# Altium project Local Master.PrjPCB
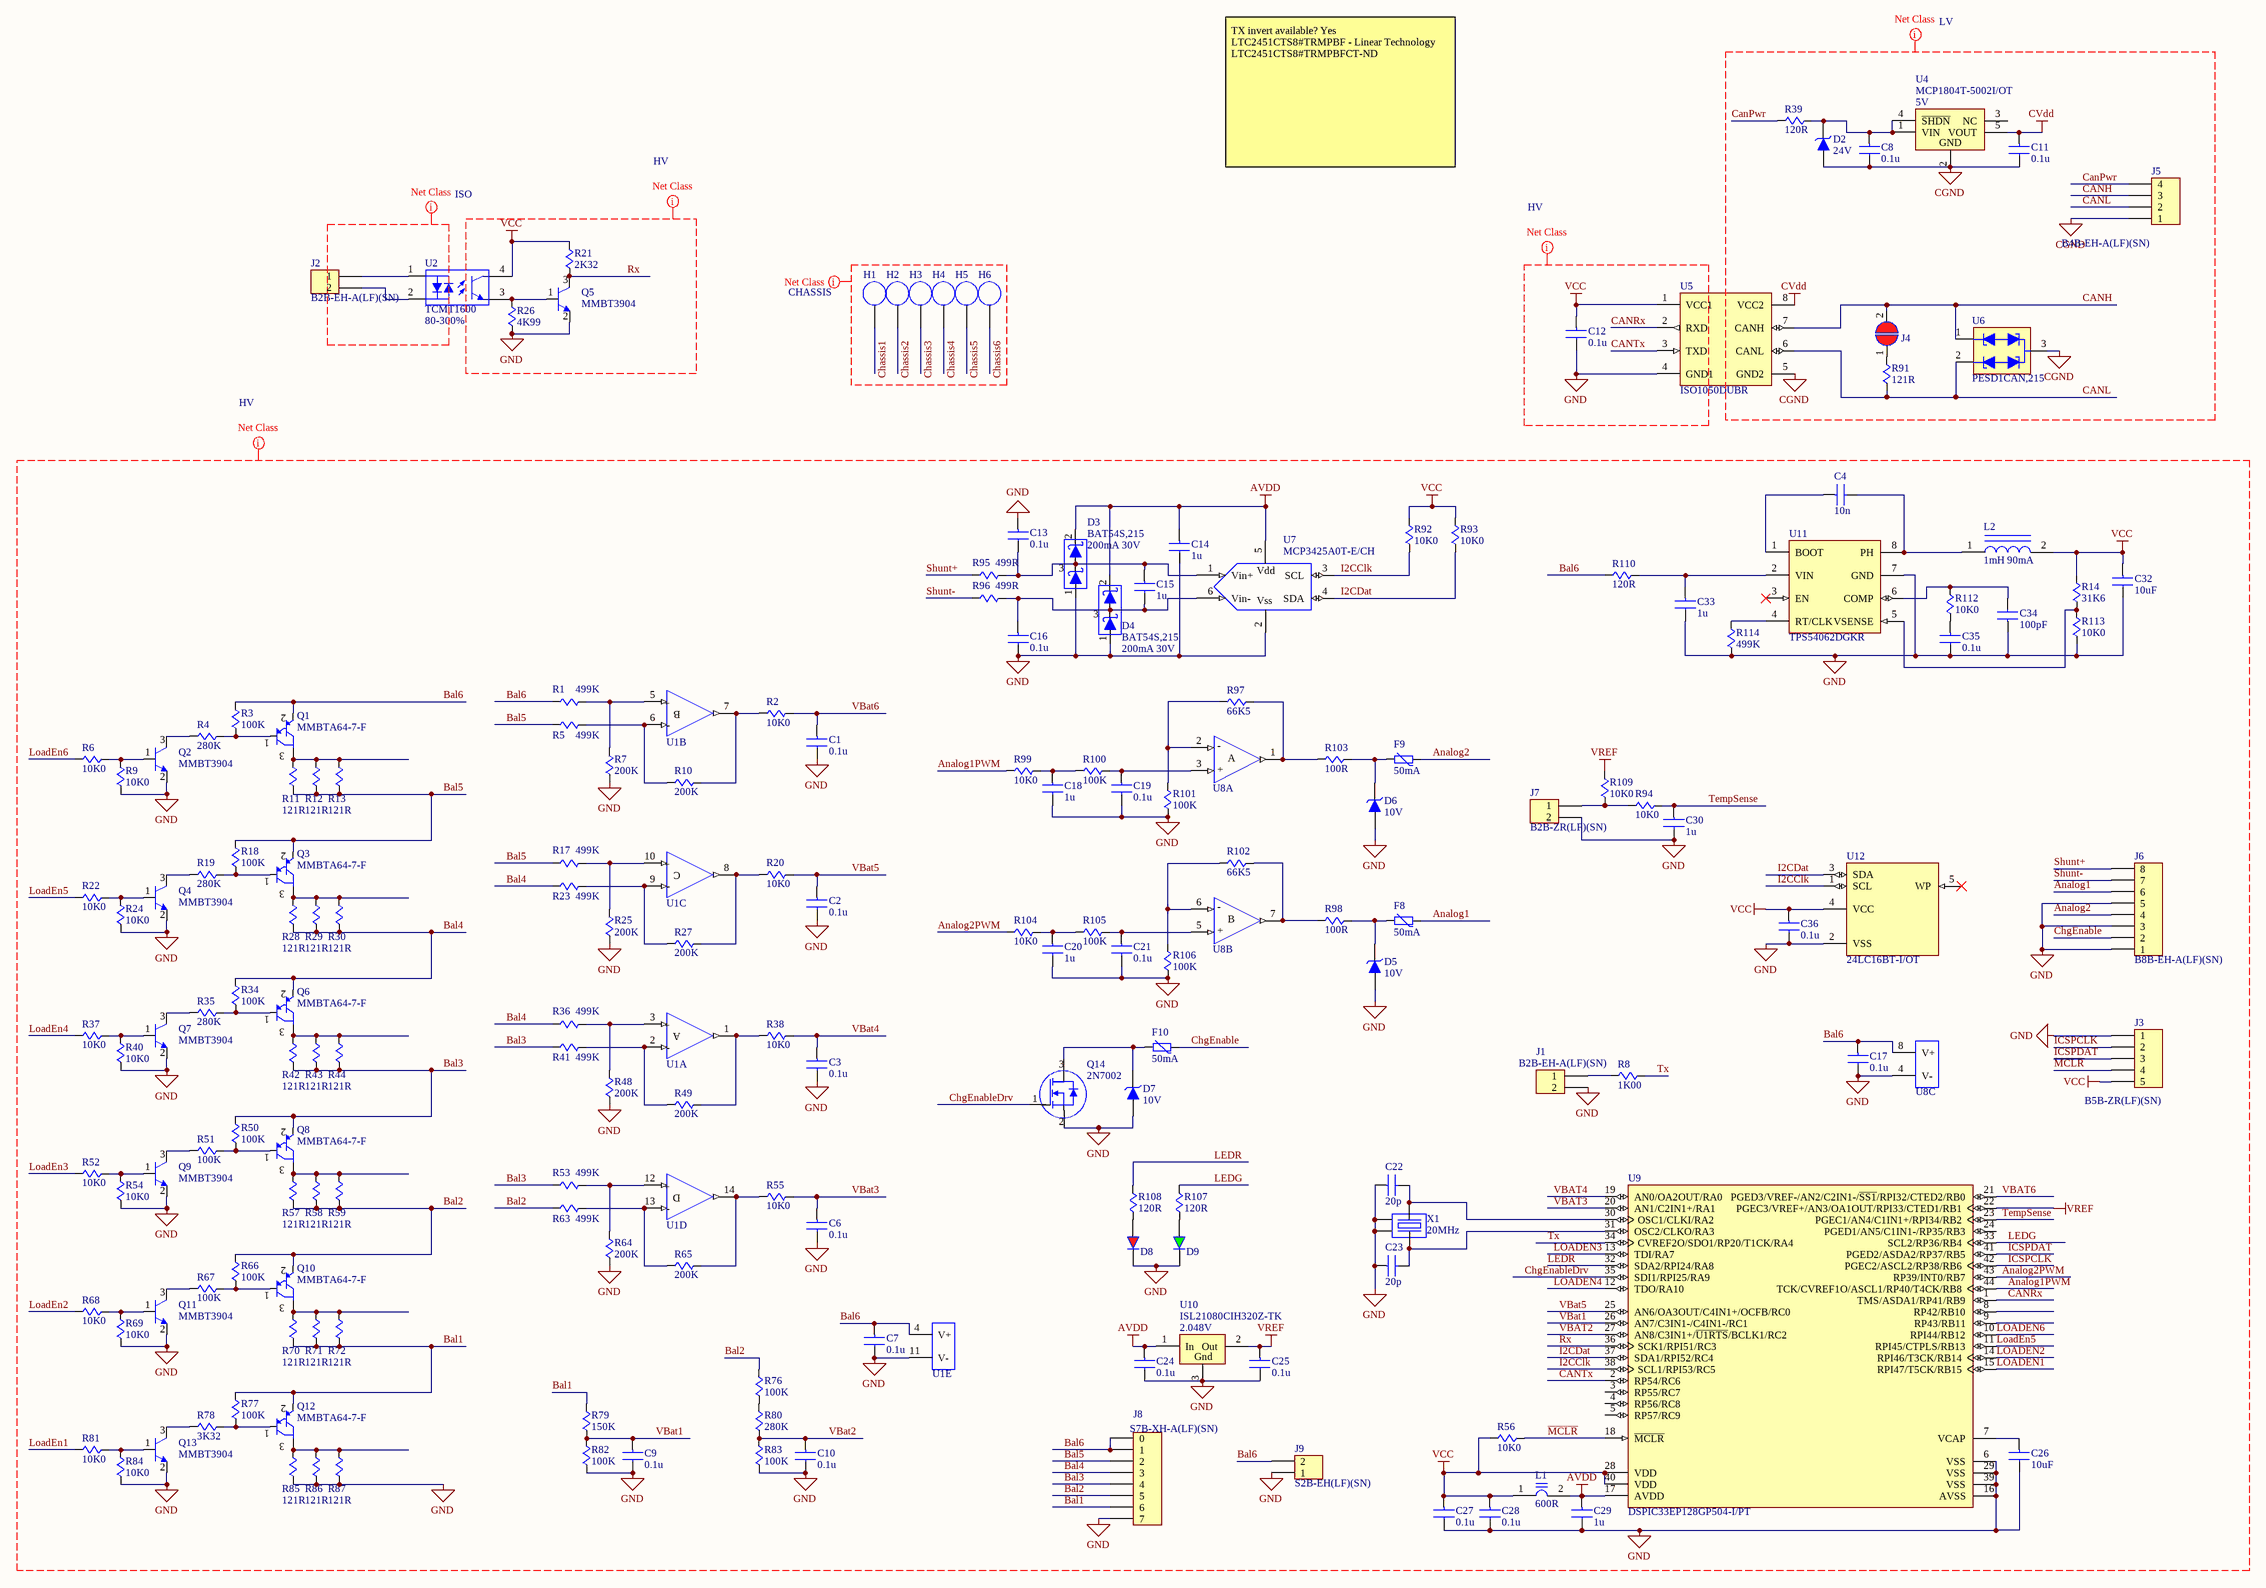
[diagram p0: Local Master.SchDoc]
1 sheet, 184 parts. Net scope: global (net labels, ports and power ports of the same name join across sheets).
Board file: Local Master.PcbDoc

## Sheet Local Master.SchDoc
size C

### Parts
C1  value 0.1u  [CAPC1608N-0603]  (hidden comment: Cap Ceramic 0.1u 25V X7R 0603)
C2  value 0.1u  [CAPC1608N-0603]  (hidden comment: Cap Ceramic 0.1u 25V X7R 0603)
C3  value 0.1u  [CAPC1608N-0603]  (hidden comment: Cap Ceramic 0.1u 25V X7R 0603)
C4  value 10n  [CAPC1608N-0603]  (hidden comment: Cap Ceramic 10n 50V X7R 0603)
C6  value 0.1u  [CAPC1608N-0603]  (hidden comment: Cap Ceramic 0.1u 25V X7R 0603)
C7  value 0.1u  [CAPC1608N-0603]  (hidden comment: Cap Ceramic 0.1u 50V X7R 0603)
C8  value 0.1u  [CAPC1608N-0603]  (hidden comment: Cap Ceramic 0.1u 50V X7R 0603)
C9  value 0.1u  [CAPC1608N-0603]  (hidden comment: Cap Ceramic 0.1u 25V X7R 0603)
C10  value 0.1u  [CAPC1608N-0603]  (hidden comment: Cap Ceramic 0.1u 25V X7R 0603)
C11  value 0.1u  [CAPC1608N-0603]  (hidden comment: Cap Ceramic 0.1u 25V X7R 0603)
C12  value 0.1u  [CAPC1608N-0603]  (hidden comment: Cap Ceramic 0.1u 25V X7R 0603)
C13  value 0.1u  [CAPC1608N-0603]  (hidden comment: Cap Ceramic 0.1u 25V X7R 0603)
C14  value 1u  [CAPC1608N-0603]  (hidden comment: Cap Ceramic 1u 25V X5R 0603)
C15  value 1u  [CAPC1608N-0603]  (hidden comment: Cap Ceramic 1u 25V X5R 0603)
C16  value 0.1u  [CAPC1608N-0603]  (hidden comment: Cap Ceramic 0.1u 25V X7R 0603)
C17  value 0.1u  [CAPC1608N-0603]  (hidden comment: Cap Ceramic 0.1u 50V X7R 0603)
C18  value 1u  [CAPC1608N-0603]  (hidden comment: Cap Ceramic 1u 25V X5R 0603)
C19  value 0.1u  [CAPC1608N-0603]  (hidden comment: Cap Ceramic 0.1u 25V X7R 0603)
C20  value 1u  [CAPC1608N-0603]  (hidden comment: Cap Ceramic 1u 25V X5R 0603)
C21  value 0.1u  [CAPC1608N-0603]  (hidden comment: Cap Ceramic 0.1u 25V X7R 0603)
C22  value 20p  [CAPC1608N-0603]  (hidden comment: Cap Ceramic 20p 50V C0G 0603)
C23  value 20p  [CAPC1608N-0603]  (hidden comment: Cap Ceramic 20p 50V C0G 0603)
C24  value 0.1u  [CAPC1608N-0603]  (hidden comment: Cap Ceramic 0.1u 25V X7R 0603)
C25  value 0.1u  [CAPC1608N-0603]  (hidden comment: Cap Ceramic 0.1u 25V X7R 0603)
C26  value 10uF  [CAPC1608N-0603]  (hidden comment: Cap Ceramic 10u 6.3V X5R 0603)
C27  value 0.1u  [CAPC1608N-0603]  (hidden comment: Cap Ceramic 0.1u 25V X7R 0603)
C28  value 0.1u  [CAPC1608N-0603]  (hidden comment: Cap Ceramic 0.1u 25V X7R 0603)
C29  value 1u  [CAPC1608N-0603]  (hidden comment: Cap Ceramic 1u 25V X5R 0603)
C30  value 1u  [CAPC1608N-0603]  (hidden comment: Cap Ceramic 1u 25V X5R 0603)
C32  value 10uF  [CAPC1608N-0603]  (hidden comment: Cap Ceramic 10u 6.3V X5R 0603)
C33  value 1u  [CAPC1608N-0603]  (hidden comment: Cap Ceramic 1u 50V X5R 0603)
C34  value 100pF  [CAPC1608N-0603]  (hidden comment: Cap Ceramic 100pF 50V C0G 0402)
C35  value 0.1u  [CAPC1608N-0603]  (hidden comment: Cap Ceramic 0.1u 25V X7R 0603)
C36  value 0.1u  [CAPC1608N-0603]  (hidden comment: Cap Ceramic 0.1u 25V X7R 0603)
D2  value 24V  [SOD-123]  (hidden comment: Diode Zener 24V 0.5W SOD-123)
D3  value 200mA 30V  [SOT23-3N]  (hidden comment: Diode Schottky 200mA 30V Series SOT-23)
D4  value 200mA 30V  [SOT23-3N]  (hidden comment: Diode Schottky 200mA 30V Series SOT-23)
D5  value 10V  [SOD-123]  (hidden comment: Diode Zener 10V 0.5W SOD-123)
D6  value 10V  [SOD-123]  (hidden comment: Diode Zener 10V 0.5W SOD-123)
D7  value 10V  [SOD-123]  (hidden comment: Diode Zener 10V 0.5W SOD-123)
D8  LED Red 160° 0603  [CAPC1608N-0603]  (value not drawn)
D9  LED Green 160° 0603  [CAPC1608N-0603]  (value not drawn)
F8  value 50mA  [RESC3216N-1206]  (hidden comment: Fuse PTC 50mA 60V 1206)
F9  value 50mA  [RESC3216N-1206]  (hidden comment: Fuse PTC 50mA 60V 1206)
F10  value 50mA  [RESC3216N-1206]  (hidden comment: Fuse PTC 50mA 60V 1206)
H1  Mounting Hole  [HOLE MOUNTING 3MM]  (value not drawn)  (no BOM)
H2  Mounting Hole  [HOLE MOUNTING 3MM]  (value not drawn)  (no BOM)
H3  Mounting Hole  [HOLE MOUNTING 3MM]  (value not drawn)  (no BOM)
H4  Mounting Hole  [HOLE MOUNTING 3MM]  (value not drawn)  (no BOM)
H5  Mounting Hole  [HOLE MOUNTING 3MM]  (value not drawn)  (no BOM)
H6  Mounting Hole  [HOLE MOUNTING 3MM]  (value not drawn)  (no BOM)
J1  value B2B-EH-A(LF)(SN)  [B2B-EH]  (hidden comment: Conn Header 2.5mm Vert 2-Pos EH)
J2  value B2B-EH-A(LF)(SN)  [B2B-EH]  (hidden comment: Conn Header 2.5mm Vert 2-Pos EH)
J3  value B5B-ZR(LF)(SN)  [B5B-ZR]  (hidden comment: Conn Header 1.5mm Vert 5-Pos ZH)
J4  Jumper Solder Blob  [JUMPER SOLDER BLOB]  (value not drawn)  (no BOM)
J5  value B4B-EH-A(LF)(SN)  [B4B-EH]  (hidden comment: Conn Header 2.5mm Vert 4-Pos EH)
J6  value B8B-EH-A(LF)(SN)  [B8B-EH]  (hidden comment: Conn Header 2.5mm Vert 8-Pos EH)
J7  value B2B-ZR(LF)(SN)  [B2B-ZR]  (hidden comment: Conn Header 1.5mm Vert 2-Pos ZH)
J8  value S7B-XH-A(LF)(SN)  [S7B-XH&78B-XH-REV]  (hidden comment: Conn Header 2.5mm RA 7-Pos XH)
J9  value S2B-EH(LF)(SN)  [S2B-EH]  (hidden comment: Conn Header 2.5mm RA 2-Pos EH)
L1  value 600R  [INDC1608N-0603]  (hidden comment: Ind Bead 600R 1A 0603)
L2  value 1mH 90mA  [SDR0403]  (hidden comment: Ind 1mH 90mA SDR0403-102KL)
Q1  value MMBTA64-7-F  [SOT23-3N]  (hidden comment: Tran PNP Darl 30V 500mA SOT-23)
Q2  value MMBT3904  [SOT23-3N]  (hidden comment: Tran NPN 40V 200mA SOT-23)
Q3  value MMBTA64-7-F  [SOT23-3N]  (hidden comment: Tran PNP Darl 30V 500mA SOT-23)
Q4  value MMBT3904  [SOT23-3N]  (hidden comment: Tran NPN 40V 200mA SOT-23)
Q5  value MMBT3904  [SOT23-3N]  (hidden comment: Tran NPN 40V 200mA SOT-23)
Q6  value MMBTA64-7-F  [SOT23-3N]  (hidden comment: Tran PNP Darl 30V 500mA SOT-23)
Q7  value MMBT3904  [SOT23-3N]  (hidden comment: Tran NPN 40V 200mA SOT-23)
Q8  value MMBTA64-7-F  [SOT23-3N]  (hidden comment: Tran PNP Darl 30V 500mA SOT-23)
Q9  value MMBT3904  [SOT23-3N]  (hidden comment: Tran NPN 40V 200mA SOT-23)
Q10  value MMBTA64-7-F  [SOT23-3N]  (hidden comment: Tran PNP Darl 30V 500mA SOT-23)
Q11  value MMBT3904  [SOT23-3N]  (hidden comment: Tran NPN 40V 200mA SOT-23)
Q12  value MMBTA64-7-F  [SOT23-3N]  (hidden comment: Tran PNP Darl 30V 500mA SOT-23)
Q13  value MMBT3904  [SOT23-3N]  (hidden comment: Tran NPN 40V 200mA SOT-23)
Q14  value 2N7002  [SOT23-3N]  (hidden comment: Tran N-MOSFET 60V 115mA SOT-23)
R1  value 499K  [RESC1608N-0603]  (hidden comment: Res 499K 1/10W 1% 0603)
R2  value 10K0  [RESC1608N-0603]  (hidden comment: Res 10.0K 1/10W 1% 0603)
R3  value 100K  [RESC1608N-0603]  (hidden comment: Res 100K 1/10W 1% 0603)
R4  value 280K  [RESC1608N-0603]  (hidden comment: Res 280K 1/10W 1% 0603)
R5  value 499K  [RESC1608N-0603]  (hidden comment: Res 499K 1/10W 1% 0603)
R6  value 10K0  [RESC1608N-0603]  (hidden comment: Res 10.0K 1/10W 1% 0603)
R7  value 200K  [RESC1608N-0603]  (hidden comment: Res 200K 1/10W 1% 0603)
R8  value 1K00  [RESC1608N-0603]  (hidden comment: Res 1.00K 1/10W 1% 0603)
R9  value 10K0  [RESC1608N-0603]  (hidden comment: Res 10.0K 1/10W 1% 0603)
R10  value 200K  [RESC1608N-0603]  (hidden comment: Res 200K 1/10W 1% 0603)
R11  value 121R  [RESC3216N-1206]  (hidden comment: Res 121R 1/4W 1% 1206)
R12  value 121R  [RESC3216N-1206]  (hidden comment: Res 121R 1/4W 1% 1206)
R13  value 121R  [RESC3216N-1206]  (hidden comment: Res 121R 1/4W 1% 1206)
R14  value 31K6  [RESC1608N-0603]  (hidden comment: Res 31.6K 1/10W 1% 0603)
R17  value 499K  [RESC1608N-0603]  (hidden comment: Res 499K 1/10W 1% 0603)
R18  value 100K  [RESC1608N-0603]  (hidden comment: Res 100K 1/10W 1% 0603)
R19  value 280K  [RESC1608N-0603]  (hidden comment: Res 280K 1/10W 1% 0603)
R20  value 10K0  [RESC1608N-0603]  (hidden comment: Res 10.0K 1/10W 1% 0603)
R21  value 2K32  [RESC1608N-0603]  (hidden comment: Res 2.32K 1/10W 1% 0603)
R22  value 10K0  [RESC1608N-0603]  (hidden comment: Res 10.0K 1/10W 1% 0603)
R23  value 499K  [RESC1608N-0603]  (hidden comment: Res 499K 1/10W 1% 0603)
R24  value 10K0  [RESC1608N-0603]  (hidden comment: Res 10.0K 1/10W 1% 0603)
R25  value 200K  [RESC1608N-0603]  (hidden comment: Res 200K 1/10W 1% 0603)
R26  value 4K99  [RESC1608N-0603]  (hidden comment: Res 4.99K 1/10W 1% 0603)
R27  value 200K  [RESC1608N-0603]  (hidden comment: Res 200K 1/10W 1% 0603)
R28  value 121R  [RESC3216N-1206]  (hidden comment: Res 121R 1/4W 1% 1206)
R29  value 121R  [RESC3216N-1206]  (hidden comment: Res 121R 1/4W 1% 1206)
R30  value 121R  [RESC3216N-1206]  (hidden comment: Res 121R 1/4W 1% 1206)
R34  value 100K  [RESC1608N-0603]  (hidden comment: Res 100K 1/10W 1% 0603)
R35  value 280K  [RESC1608N-0603]  (hidden comment: Res 280K 1/10W 1% 0603)
R36  value 499K  [RESC1608N-0603]  (hidden comment: Res 499K 1/10W 1% 0603)
R37  value 10K0  [RESC1608N-0603]  (hidden comment: Res 10.0K 1/10W 1% 0603)
R38  value 10K0  [RESC1608N-0603]  (hidden comment: Res 10.0K 1/10W 1% 0603)
R39  value 120R  [RESC1608N-0603]  (hidden comment: Res 120R 1/10W 1% 0603)
R40  value 10K0  [RESC1608N-0603]  (hidden comment: Res 10.0K 1/10W 1% 0603)
R41  value 499K  [RESC1608N-0603]  (hidden comment: Res 499K 1/10W 1% 0603)
R42  value 121R  [RESC3216N-1206]  (hidden comment: Res 121R 1/4W 1% 1206)
R43  value 121R  [RESC3216N-1206]  (hidden comment: Res 121R 1/4W 1% 1206)
R44  value 121R  [RESC3216N-1206]  (hidden comment: Res 121R 1/4W 1% 1206)
R48  value 200K  [RESC1608N-0603]  (hidden comment: Res 200K 1/10W 1% 0603)
R49  value 200K  [RESC1608N-0603]  (hidden comment: Res 200K 1/10W 1% 0603)
R50  value 100K  [RESC1608N-0603]  (hidden comment: Res 100K 1/10W 1% 0603)
R51  value 100K  [RESC1608N-0603]  (hidden comment: Res 100K 1/10W 1% 0603)
R52  value 10K0  [RESC1608N-0603]  (hidden comment: Res 10.0K 1/10W 1% 0603)
R53  value 499K  [RESC1608N-0603]  (hidden comment: Res 499K 1/10W 1% 0603)
R54  value 10K0  [RESC1608N-0603]  (hidden comment: Res 10.0K 1/10W 1% 0603)
R55  value 10K0  [RESC1608N-0603]  (hidden comment: Res 10.0K 1/10W 1% 0603)
R56  value 10K0  [RESC1608N-0603]  (hidden comment: Res 10.0K 1/10W 1% 0603)
R57  value 121R  [RESC3216N-1206]  (hidden comment: Res 121R 1/4W 1% 1206)
R58  value 121R  [RESC3216N-1206]  (hidden comment: Res 121R 1/4W 1% 1206)
R59  value 121R  [RESC3216N-1206]  (hidden comment: Res 121R 1/4W 1% 1206)
R63  value 499K  [RESC1608N-0603]  (hidden comment: Res 499K 1/10W 1% 0603)
R64  value 200K  [RESC1608N-0603]  (hidden comment: Res 200K 1/10W 1% 0603)
R65  value 200K  [RESC1608N-0603]  (hidden comment: Res 200K 1/10W 1% 0603)
R66  value 100K  [RESC1608N-0603]  (hidden comment: Res 100K 1/10W 1% 0603)
R67  value 100K  [RESC1608N-0603]  (hidden comment: Res 100K 1/10W 1% 0603)
R68  value 10K0  [RESC1608N-0603]  (hidden comment: Res 10.0K 1/10W 1% 0603)
R69  value 10K0  [RESC1608N-0603]  (hidden comment: Res 10.0K 1/10W 1% 0603)
R70  value 121R  [RESC3216N-1206]  (hidden comment: Res 121R 1/4W 1% 1206)
R71  value 121R  [RESC3216N-1206]  (hidden comment: Res 121R 1/4W 1% 1206)
R72  value 121R  [RESC3216N-1206]  (hidden comment: Res 121R 1/4W 1% 1206)
R76  value 100K  [RESC1608N-0603]  (hidden comment: Res 100K 1/10W 1% 0603)
R77  value 100K  [RESC1608N-0603]  (hidden comment: Res 100K 1/10W 1% 0603)
R78  value 3K32  [RESC1608N-0603]  (hidden comment: Res 3.32K 1/10W 1% 0603)
R79  value 150K  [RESC1608N-0603]  (hidden comment: Res 150K 1/10W 1% 0603)
R80  value 280K  [RESC1608N-0603]  (hidden comment: Res 280K 1/10W 1% 0603)
R81  value 10K0  [RESC1608N-0603]  (hidden comment: Res 10.0K 1/10W 1% 0603)
R82  value 100K  [RESC1608N-0603]  (hidden comment: Res 100K 1/10W 1% 0603)
R83  value 100K  [RESC1608N-0603]  (hidden comment: Res 100K 1/10W 1% 0603)
R84  value 10K0  [RESC1608N-0603]  (hidden comment: Res 10.0K 1/10W 1% 0603)
R85  value 121R  [RESC3216N-1206]  (hidden comment: Res 121R 1/4W 1% 1206)
R86  value 121R  [RESC3216N-1206]  (hidden comment: Res 121R 1/4W 1% 1206)
R87  value 121R  [RESC3216N-1206]  (hidden comment: Res 121R 1/4W 1% 1206)
R91  value 121R  [RESC3216N-1206]  (hidden comment: Res 121R 1/4W 1% 1206)
R92  value 10K0  [RESC1608N-0603]  (hidden comment: Res 10.0K 1/10W 1% 0603)
R93  value 10K0  [RESC1608N-0603]  (hidden comment: Res 10.0K 1/10W 1% 0603)
R94  value 10K0  [RESC1608N-0603]  (hidden comment: Res 10.0K 1/10W 1% 0603)
R95  value 499R  [RESC1608N-0603]  (hidden comment: Res 499R 1/10W 1% 0603)
R96  value 499R  [RESC1608N-0603]  (hidden comment: Res 499R 1/10W 1% 0603)
R97  value 66K5  [RESC1608N-0603]  (hidden comment: Res 66.5K 1/10W 1% 0603)
R98  value 100R  [RESC1608N-0603]  (hidden comment: Res 100R 1/10W 1% 0603)
R99  value 10K0  [RESC1608N-0603]  (hidden comment: Res 10.0K 1/10W 1% 0603)
R100  value 100K  [RESC1608N-0603]  (hidden comment: Res 100K 1/10W 1% 0603)
R101  value 100K  [RESC1608N-0603]  (hidden comment: Res 100K 1/10W 1% 0603)
R102  value 66K5  [RESC1608N-0603]  (hidden comment: Res 66.5K 1/10W 1% 0603)
R103  value 100R  [RESC1608N-0603]  (hidden comment: Res 100R 1/10W 1% 0603)
R104  value 10K0  [RESC1608N-0603]  (hidden comment: Res 10.0K 1/10W 1% 0603)
R105  value 100K  [RESC1608N-0603]  (hidden comment: Res 100K 1/10W 1% 0603)
R106  value 100K  [RESC1608N-0603]  (hidden comment: Res 100K 1/10W 1% 0603)
R107  value 120R  [RESC1608N-0603]  (hidden comment: Res 120R 1/10W 1% 0603)
R108  value 120R  [RESC1608N-0603]  (hidden comment: Res 120R 1/10W 1% 0603)
R109  value 10K0  [RESC1608N-0603]  (hidden comment: Res 10.0K 1/10W 1% 0603)
R110  value 120R  [RESC1608N-0603]  (hidden comment: Res 120R 1/10W 1% 0603)
R112  value 10K0  [RESC1608N-0603]  (hidden comment: Res 10.0K 1/10W 1% 0603)
R113  value 10K0  [RESC1608N-0603]  (hidden comment: Res 10.0K 1/10W 1% 0603)
R114  value 499K  [RESC1608N-0603]  (hidden comment: Res 499K 1/10W 1% 0603)
U1  IC Op-Amp Low Power RRIO 32V 14-SOIC  [SOIC127P600-14N]  (value not drawn)  (parts A,B,C,D,E of 5)
U2  value 80-300%  [MFP127P4.4-4]  (hidden comment: IC Optocoupler Bi-Di LED 80-300% SOIC4)
U4  value 5V  [SOT23-5N]  (hidden comment: IC Voltage Reg LDO 5V SOT-23-5)
U5  value ISO1050DUBR  [SMD-8]  (hidden comment: IC Driver CAN 8-SOIC)
U6  value PESD1CAN,215  [SOT23-3N]  (hidden comment: IC ESD Protector CAN SOT23)
U7  MCP3425A0T-E/CH  [SOT23-6N]
U8  IC Op-Amp Low Power RRIO 32V 8-SOIC  [SOIC127P600-8N]  (value not drawn)  (parts A,B,C of 3)
U9  value DSPIC33EP128GP504-I/PT  [TQFP44-0.8]  (hidden comment: IC Micro DSPIC33EP128GP504-I/PT 44-TQFP)
U10  value 2.048V  [SOT23-3N]  (hidden comment: IC Voltage Ref 2.048V 0.3% uPwr SOT-23)
U11  value TPS54062DGKR  [MSOP65P3.0-8N]  (hidden comment: IC Reg Buck 4.7-60V 50mA 8-MSOP)
U12  value 24LC16BT-I/OT  [SOT23-5N]  (hidden comment: IC Mem EEPROM 16Kb (2K x 8) I2C SOT-23-5)
X1  value 20MHz  [XTAL3.2X2.5]  (hidden comment: Xtal 20MHz 10pF 3.2X2.5MM)

### Nets
AVDD: C14.1 C24.1 C29.1 D3.2(Anode2) D4.2(Anode2) L1.2 U7.5(Vdd) U9.17(AVDD) U10.1(In)
CGND: C8.2 C11.2 D2.2(Anode) J5.1 U4.2(GND) U5.5(GND2) U6.3(Com)
CVdd: C11.1 U4.5(VOUT) U5.8(VCC2)
GND: C1.2 C2.2 C3.2 C6.2 C7.2 C9.2 C10.2 C12.2 C13.1 C14.2 C16.2 C17.2 C18.2 C19.2 C20.2 C21.2 C22.1 C23.1 C24.2 C25.2 C26.2 C27.2 C28.2 C29.2 C30.2 C32.2 C33.2 C34.1 C35.2 C36.2 D3.1(Anode1) D4.1(Anode1) D5.2(Anode) D6.2(Anode) D7.2(Anode) D8.1(Cathode) D9.1(Cathode) J1.2 J3.1 J6.1 J6.3 J6.5 J7.2 J8.7 J9.1 Q2.2(E) Q4.2(E) Q5.2(E) Q7.2(E) Q9.2(E) Q11.2(E) Q13.2(E) Q14.2(Source) R7.1 R9.1 R24.1 R25.1 R26.1 R40.1 R48.1 R54.1 R64.1 R69.1 R82.1 R83.1 R84.1 R85.1 R86.1 R87.1 R101.1 R106.1 R113.1 R114.1 U1.11(V-) U5.4(GND1) U7.2(Vss) U8.4(V-) U9.6(VSS) U9.16(AVSS) U9.29(VSS) U9.39(VSS) U10.3(Gnd) U11.7(GND) U12.2(VSS) X1.2 X1.4
VCC: C12.1 C27.1 C28.1 C32.1 C36.1 J3.5 L1.1 L2.2 R14.2 R21.2 R56.2 R92.2 R93.2 U2.4(Collector) U5.1(VCC1) U9.28(VDD) U9.40(VDD) U12.4(VCC)
VREF: C25.1 R109.2 U9.22(PGEC3/VREF+/AN3/OA1OUT/RPI33/CTED1/RB1) U10.2(Out)
Analog1: F8.2 J6.6
Analog1PWM: R99.1 U9.44(TCK/CVREF1O/ASCL1/RP40/T4CK/RB8)
Analog2: F9.2 J6.4
Analog2PWM: R104.1 U9.43(RP39/INT0/RB7)
Bal1: J8.6 Q12.2(Emitter) R70.1 R71.1 R72.1 R77.2 R79.2
Bal2: J8.5 Q10.2(Emitter) R57.1 R58.1 R59.1 R63.1 R66.2 R76.2
Bal3: J8.4 Q8.2(Emitter) R41.1 R42.1 R43.1 R44.1 R50.2 R53.1
Bal4: J8.3 Q6.2(Emitter) R23.1 R28.1 R29.1 R30.1 R34.2 R36.1
Bal5: J8.2 Q3.2(Emitter) R5.1 R11.1 R12.1 R13.1 R17.1 R18.2
Bal6: C7.1 C17.1 J8.0 J8.1 J9.2 Q1.2(Emitter) R1.1 R3.2 R110.1 U1.4(V+) U8.8(V+)
CANH: J4.2 J5.3 U5.7(CANH) U6.1(C1)
CANL: J5.2 R91.1 U5.6(CANL) U6.2(C2)
CanPwr: J5.4 R39.2
CANRx: U5.2(RXD) U9.1(TMS/ASDA1/RP41/RB9)
CANTx: U5.3(TXD) U9.2(RP54/RC6)
Chassis1: H1.1
Chassis2: H2.1
Chassis3: H3.1
Chassis4: H4.1
Chassis5: H5.1
Chassis6: H6.1
ChgEnable: F10.2 J6.2
ChgEnableDrv: Q14.1(Gate) U9.35(SDI1/RPI25/RA9)
I2CClk: R92.1 U7.3(SCL) U9.38(SCL1/RPI53/RC5) U12.1(SCL)
I2CDat: R93.1 U7.4(SDA) U9.37(SDA1/RPI52/RC4) U12.3(SDA)
ICSPCLK: J3.2 U9.42(PGEC2/ASCL2/RP38/RB6)
ICSPDAT: J3.3 U9.41(PGED2/ASDA2/RP37/RB5)
LEDG: R107.1 U9.33(SCL2/RP36/RB4)
LEDR: R108.1 U9.32(SDA2/RPI24/RA8)
LoadEn1: R81.2 U9.15(RPI47/T5CK/RB15)
LoadEn2: R68.2 U9.14(RPI46/T3CK/RB14)
LoadEn3: R52.2 U9.13(TDI/RA7)
LoadEn4: R37.2 U9.12(TDO/RA10)
LoadEn5: R22.2 U9.11(RPI45/CTPLS/RB13)
LoadEn6: R6.2 U9.10(RPI44/RB12)
~{MCLR}: J3.4 R56.1 U9.18(~{MCLR})
Rx: Q5.3(C) R21.1 U9.36(SCK1/RPI51/RC3)
Shunt+: J6.8 R95.1
Shunt-: J6.7 R96.1
TempSense: C30.1 R94.1 U9.23(PGEC1/AN4/C1IN1+/RPI34/RB2)
Tx: R8.2 U9.34(CVREF2O/SDO1/RP20/T1CK/RA4)
VBat1: C9.1 R79.1 R82.2 U9.26(AN7/C3IN1-/C4IN1-/RC1)
VBat2: C10.1 R80.1 R83.2 U9.27(AN8/C3IN1+/~{U1RTS}/BCLK1/RC2)
VBat3: C6.1 R55.2 U9.20(AN1/C2IN1+/RA1)
VBat4: C3.1 R38.2 U9.19(AN0/OA2OUT/RA0)
VBat5: C2.1 R20.2 U9.25(AN6/OA3OUT/C4IN1+/OCFB/RC0)
VBat6: C1.1 R2.2 U9.21(PGED3/VREF-/AN2/C2IN1-/~{SS1}/RPI32/CTED2/RB0)
NetC4_1: C4.1 U11.1(BOOT)
NetC4_2: C4.2 L2.1 U11.8(PH)
NetC8_1: C8.1 D2.1(Cathode) R39.1 U4.1(VIN) U4.4(~{SHDN})
NetC13_2: C13.2 C15.1 D3.3(Cathode) R95.2 U7.1(Vin+)
NetC15_2: C15.2 C16.1 D4.3(Cathode) R96.2 U7.6(Vin-)
NetC18_1: C18.1 R99.2 R100.1
NetC19_1: C19.1 R100.2 U8.3(+A)
NetC20_1: C20.1 R104.2 R105.1
NetC21_1: C21.1 R105.2 U8.5(+B)
NetC22_2: C22.2 U9.30(OSC1/CLKI/RA2) X1.3
NetC23_2: C23.2 U9.31(OSC2/CLKO/RA3) X1.1
NetC26_1: C26.1 U9.7(VCAP)
NetC33_1: C33.1 R110.2 U11.2(VIN)
NetC34_2: C34.2 R112.1 U11.6(COMP)
NetC35_1: C35.1 R112.2
NetD5_1: D5.1(Cathode) F8.1 R98.2
NetD6_1: D6.1(Cathode) F9.1 R103.2
NetD7_1: D7.1(Cathode) F10.1 Q14.3(Drain)
NetD8_2: D8.2(Anode) R108.2
NetD9_2: D9.2(Anode) R107.2
NetJ1_1: J1.1 R8.1
NetJ2_1: J2.1 U2.1(Anode)
NetJ2_2: J2.2 U2.2(Cathode)
NetJ4_1: J4.1 R91.2
NetJ7_1: J7.1 R94.2 R109.1
NetQ1_1: Q1.1(Base) R3.1 R4.1
NetQ1_3: Q1.3(Collector) R11.2 R12.2 R13.2
NetQ2_1: Q2.1(B) R6.1 R9.2
NetQ2_3: Q2.3(C) R4.2
NetQ3_1: Q3.1(Base) R18.1 R19.1
NetQ3_3: Q3.3(Collector) R28.2 R29.2 R30.2
NetQ4_1: Q4.1(B) R22.1 R24.2
NetQ4_3: Q4.3(C) R19.2
NetQ5_1: Q5.1(B) R26.2 U2.3(Emitter)
NetQ6_1: Q6.1(Base) R34.1 R35.1
NetQ6_3: Q6.3(Collector) R42.2 R43.2 R44.2
NetQ7_1: Q7.1(B) R37.1 R40.2
NetQ7_3: Q7.3(C) R35.2
NetQ8_1: Q8.1(Base) R50.1 R51.1
NetQ8_3: Q8.3(Collector) R57.2 R58.2 R59.2
NetQ9_1: Q9.1(B) R52.1 R54.2
NetQ9_3: Q9.3(C) R51.2
NetQ10_1: Q10.1(Base) R66.1 R67.1
NetQ10_3: Q10.3(Collector) R70.2 R71.2 R72.2
NetQ11_1: Q11.1(B) R68.1 R69.2
NetQ11_3: Q11.3(C) R67.2
NetQ12_1: Q12.1(Base) R77.1 R78.1
NetQ12_3: Q12.3(Collector) R85.2 R86.2 R87.2
NetQ13_1: Q13.1(B) R81.1 R84.2
NetQ13_3: Q13.3(C) R78.2
NetR1_2: R1.2 R7.2 U1.5(+B)
NetR2_1: R2.1 R10.2 U1.7(Output_A)
NetR5_2: R5.2 R10.1 U1.6(-B)
NetR14_1: R14.1 R113.2 U11.5(VSENSE)
NetR17_2: R17.2 R25.2 U1.10(+C)
NetR20_1: R20.1 R27.2 U1.8(Output_A)
NetR23_2: R23.2 R27.1 U1.9(-C)
NetR36_2: R36.2 R48.2 U1.3(+A)
NetR38_1: R38.1 R49.2 U1.1(Output_A)
NetR41_2: R41.2 R49.1 U1.2(-A)
NetR53_2: R53.2 R64.2 U1.12(+D)
NetR55_1: R55.1 R65.2 U1.14(Output_A)
NetR63_2: R63.2 R65.1 U1.13(-D)
NetR76_1: R76.1 R80.2
NetR97_1: R97.1 R101.2 U8.2(-A)
NetR97_2: R97.2 R103.1 U8.1(Output_A)
NetR98_1: R98.1 R102.2 U8.7(Output_A)
NetR102_1: R102.1 R106.2 U8.6(-B)
NetR114_2: R114.2 U11.4(RT/CLK)

Not connected (* = marked no-connect by the designer): U4 3(NC); U9 3(RP55/RC7) 4(RP56/RC8) 5(RP57/RC9) 8(RP42/RB10) 9(RP43/RB11) 24(PGED1/AN5/C1IN1-/RP35/RB3); U11 3(EN)*; U12 5(WP)*

### Layout directives
net class ISO: (no net found under the mark)
net class CHASSIS: Chassis1, Chassis2, Chassis3, Chassis4, Chassis5, Chassis6
net class LV: CANH, CANL, CanPwr, CGND, CVdd
net class HV: Analog1, Analog1PWM, Analog2, Analog2PWM, AVDD, Bal1, Bal2, Bal3, Bal4, Bal5, Bal6, CANRx, CANTx, ChgEnable, ChgEnableDrv, GND, I2CClk, I2CDat, ICSPCLK, ICSPDAT, LEDG, LEDR, LOADEN1, LoadEn1, LOADEN2, LoadEn2, LoadEn3, LOADEN3, LoadEn4, LOADEN4, LoadEn5, LOADEN6, LoadEn6, Rx, Shunt+, Shunt-, TempSense, Tx, VBat1, VBat2, VBAT2, VBat3, VBAT3, VBAT4, VBat4, VBat5, VBat6, VBAT6, VCC, VREF, ~{MCLR}

### Notes on the sheet
- TX invert available? Yes
  LTC2451CTS8#TRMPBF - Linear Technology	LTC2451CTS8#TRMPBFCT-ND
- (in symbol LP324DR, part A) +; A; -
- (in symbol LP324DR, part B) +; B; -
- (in symbol LP324DR, part C) +; C; -
- (in symbol LP324DR, part D) +; D; -
- (in symbol LP358DR, part A) -; A; +
- (in symbol LP358DR, part B) -; B; +

### Library data of the parts
C1-C3 C6 C9-C13 C16 C19 C21 C24 C25 C27 C28 C35 C36 = C0603C104K3RACTU: Dist: Digi-Key; Dist P/N: 399-1281-1-ND; Mfg: Kemet; Mfgr P/N: C0603C104K3RACTU; Price: 0.079
C4 = C1608X7R1H103J: Dist: Digi-Key; Dist P/N: 445-1348-1-ND; Mfg: TDK; Mfgr P/N: C1608X7R1H103J; Price: 0.047
C7 C8 C17 = CC0603KRX7R9BB104: Dist: Digi-Key; Dist P/N: 311-1344-1-ND; Mfg: Yageo; Mfgr P/N: CC0603KRX7R9BB104; Price: 0.35
C14 C15 C18 C20 C29 C30 = C1608X5R1E105K: Dist: Digi-Key; Dist P/N: 445-5146-1-ND; Mfg: TDK; Mfgr P/N: C1608X5R1E105K; Price: 0.093
C22 C23 = GRM1885C1H200JA01D: Dist: Digi-Key; Dist P/N: 490-1410-1-ND; Mfg: Murata; Mfgr P/N: GRM1885C1H200JA01D; Price: 0.06; HelpURL: http://search.murata.co.jp/Ceramy/image/img/A18X/C2ED01.pdf
C26 C32 = C1608X5R0J106M: Dist: Digi-Key; Dist P/N: 445-4112-1-ND; Mfg: TDK; Mfgr P/N: C1608X5R0J106M; Price: 0.46; HelpURL: http://www.tdk.com/pdf/general_B11.pdf
C33 = CL10A105KB8NNNC: Dist: Digi-Key; Dist P/N: 1276-1860-1-ND; Mfg: Samsung Electro-Mechanics; Mfgr P/N: CL10A105KB8NNNC; Price: 0.28
C34 = CGA2B2C0G1H101J050BA: Dist: Digi-Key; Dist P/N: 445-5596-1-ND; Mfg: TDK; Mfgr P/N: CGA2B2C0G1H101J050BA; Price: 0.15; HelpURL: http://www.tdk.com/pdf/general_A11.pdf
D2 = MMSZ5252B-TP: Dist: Digi-Key; Dist P/N: MMSZ5252B-TPMSCT-ND; Mfg: MCC; Mfgr P/N: MMSZ5252B-TP; Price: 0.40; Datasheet: http://61.222.192.61/mccsemi/up_pdf/MMSZ5221-MMSZ5259(SOD123).pdf
D3 D4 = BAT54S,215: Dist: Digi-Key; Dist P/N: 568-1614-1-ND; Mfg: NXP Semiconductors; Price: 0.47; Datasheet: http://www.nxp.com/documents/data_sheet/BAT54_SERIES.pdf; Mfgr P/N: BAT54S,215
D5-D7 = BZT52C10-TP: Dist: Digi-Key; Dist P/N: BZT52C10-TPMSCT-ND; Mfg: MCC; Mfgr P/N: BZT52C10-TP; Price: 0.38; Datasheet: http://61.222.192.61/mccsemi/up_pdf/MMSZ5221-MMSZ5259(SOD123).pdf
D8 = LS Q971-KN-1: Dist: Digi-Key; Dist P/N: 475-3016-1-ND; Mfg: Osram; Price: 0.08; HelpURL: http://catalog.osram-os.com/catalogue/catalogue.do;jsessionid=9BFE627FDBFBCB7D1CA4E61E5C2777C5?act=downloadFile&favOid=0200000600004f6a000100b6; Mfgr P/N: LS Q971-KN-1; Value: LS Q971-KN-1
D9 = LG Q971-KN-1: Dist: Digi-Key; Dist P/N: 475-1409-1-ND; Mfg: Osram; Price: 0.11; HelpURL: http://catalog.osram-os.com/catalogue/catalogue.do;jsessionid=60BD7AD44689CBF6EBE1906F01C7D3CB?act=downloadFile&favOid=0200000300015082000200b6; Mfgr P/N: LG Q971-KN-1; Value: LG Q971-KN-1
F8-F10 = 0ZCA0005FF2E: Dist: Digi-Key; Dist P/N: 507-1476-1-ND; Mfg: Bel Fuse; Mfgr P/N: 0ZCA0005FF2E; Price: 0.28; HelpURL: http://www.belfuse.com/Data/Datasheets/0ZCA.pdf
H1-H6 = Hole Mounting
J1 J2 = B2B-EH-A(LF)(SN): Dist: Digi-Key; Dist P/N: 455-1611-ND; Mfg: JST; Mfgr P/N: B2B-EH-A(LF)(SN); Price: 0.13; HelpURL: http://www.jst-mfg.com/product/pdf/eng/eEH.pdf
J3 = B5B-ZR(LF)(SN): Dist: Digi-Key; Dist P/N: 455-1660-ND; Mfg: JST; Mfgr P/N: B5B-ZR(LF)(SN); Price: 0.2; HelpURL: http://www.jst-mfg.com/product/pdf/eng/eZH.pdf
J5 = B4B-EH-A(LF)(SN): Dist: Digi-Key; Dist P/N: 455-1613-ND; Mfg: JST; Mfgr P/N: B4B-EH-A(LF)(SN); Price: 0.19; HelpURL: http://www.jst-mfg.com/product/pdf/eng/eEH.pdf
J6 = B8B-EH-A(LF)(SN): Dist: Digi-Key; Dist P/N: 455-1617-ND; Mfg: JST; Mfgr P/N: B8B-EH-A(LF)(SN); Price: 0.32; HelpURL: http://www.jst-mfg.com/product/pdf/eng/eEH.pdf
J7 = B2B-ZR(LF)(SN): Dist: Digi-Key; Dist P/N: 455-1657-ND; Mfg: JST; Mfgr P/N: B2B-ZR(LF)(SN); Price: 0.11; HelpURL: http://www.jst-mfg.com/product/pdf/eng/eZH.pdf
J8 = S8B-XH-A(LF)(SN)_CUST: Dist: Digi-Key; Dist P/N: 455-2240-ND; Mfg: JST; Mfgr P/N: S7B-XH-A(LF)(SN); Price: 0.43; HelpURL: http://www.jst-mfg.com/product/pdf/eng/eXH.pdf
J9 = S2B-EH(LF)(SN): Dist: Digi-Key; Dist P/N: 455-1625-ND; Mfg: JST; Mfgr P/N: S2B-EH(LF)(SN); Price: 0.16; HelpURL: http://www.jst-mfg.com/product/pdf/eng/eEH.pdf
L1 = MI0603J601R-10: Dist: Digi-Key; Dist P/N: 240-2371-1-ND; Mfg: Laird; Mfgr P/N: MI0603J601R-10; Price: 0.087; HelpURL: http://www.steward.com/view_print.asp?St_PartNo=MI0603J601R-10
L2 = MDWK4040T1R0MM: Dist: Digi-Key; Dist P/N: SDR0403-102KLCT-ND; Mfg: Bourns; Mfgr P/N: SDR0403-102KL; Price: 0.69; HelpURL: https://www.bourns.com/docs/Product-Datasheets/sdr0403.pdf
Q1 Q3 Q6 Q8 Q10 Q12 = MMBTA64-7-F: Dist: Digi-Key; Dist P/N: MMBTA64-FDICT-ND; Mfg: Diodes Inc; Mfgr P/N: MMBTA64-7-F; Price: 0.27; HelpURL: http://www.diodes.com/datasheets/ds30055.pdf
Q2 Q4 Q5 Q7 Q9 Q11 Q13 = MMBT3904: Dist: Digi-Key; Dist P/N: MMBT3904FSCT-ND; Mfg: Fairchild; Mfgr P/N: MMBT3904; Price: 0.37; Datasheet: http://www.fairchildsemi.com/ds/MM/MMBT3904.pdf
Q14 = 2N7002: Dist: Digi-Key; Dist P/N: 2N7002NCT-ND; Mfg: Fairchild Semiconductor; Mfgr P/N: 2N7002; Price: 0.56; Datasheet: http://www.fairchildsemi.com/ds/2N/2N7000.pdf
R1 R5 R17 R23 R36 R41 R53 R63 R114 = ERJ-3EKF4993V: Dist: Digi-Key; Dist P/N: P499KHCT-ND; Mfg: Panasonic; Mfgr P/N: ERJ-3EKF4993V; Price: 0.05
R2 R6 R9 R20 R22 R24 R37 R38 R40 R52 R54-R56 R68 R69 R81 R84 R92-R94 R99 R104 R109 R112 R113 = ERJ-3EKF1002V: Dist: Digi-Key; Dist P/N: P10.0KHCT-ND; Mfg: Panasonic; Mfgr P/N: ERJ-3EKF1002V; Price: 0.05
R3 R18 R34 R50 R51 R66 R67 R76 R77 R82 R83 R100 R101 R105 R106 = ERJ-3EKF1003V: Dist: Digi-Key; Dist P/N: P100KHCT-ND; Mfg: Panasonic; Mfgr P/N: ERJ-3EKF1003V; Price: 0.05
R4 R19 R35 R80 = ERJ-3EKF2803V: Dist: Digi-Key; Dist P/N: P280KHCT-ND; Mfg: Panasonic; Mfgr P/N: ERJ-3EKF2803V; Price: 0.05
R7 R10 R25 R27 R48 R49 R64 R65 = ERJ-3EKF2003V: Dist: Digi-Key; Dist P/N: P200KHCT-ND; Mfg: Panasonic; Mfgr P/N: ERJ-3EKF2003V; Price: 0.05
R8 = ERJ-3EKF1001V: Dist: Digi-Key; Dist P/N: P1.00KHCT-ND; Mfg: Panasonic; Mfgr P/N: ERJ-3EKF1001V; Price: 0.05
R11-R13 R28-R30 R42-R44 R57-R59 R70-R72 R85-R87 R91 = ERJ-8ENF1210V: Dist: Digi-Key; Dist P/N: P121FCT-ND; Mfg: Panasonic; Mfgr P/N: ERJ-8ENF1210V; Price: 0.10; HelpURL: http://industrial.panasonic.com/www-cgi/jvcr13pz.cgi?E+PZ+3+AOA0002+ERJ8ENF22R1V+7+WW
R14 = ERJ-3EKF3162V: Dist: Digi-Key; Dist P/N: P31.6KHCT-ND; Mfg: Panasonic; Mfgr P/N: ERJ-3EKF3162V; Price: 0.05
R21 = ERJ-3EKF2321V: Dist: Digi-Key; Dist P/N: P2.32KHCT-ND; Mfg: Panasonic; Mfgr P/N: ERJ-3EKF2321V; Price: 0.05
R26 = ERJ-3EKF4991V: Dist: Digi-Key; Dist P/N: P4.99KHCT-ND; Mfg: Panasonic; Mfgr P/N: ERJ-3EKF4991V; Price: 0.05
R39 R107 R108 R110 = ERJ-3EKF1200V: Dist: Digi-Key; Dist P/N: P120HCT-ND; Mfg: Panasonic; Mfgr P/N: ERJ-3EKF1200V; Price: 0.05
R78 = ERJ-3EKF3322V: Dist: Digi-Key; Dist P/N: P3.32KHCT-ND; Mfg: Panasonic; Mfgr P/N: ERJ-3EKF3322V; Price: 0.05
R79 = ERJ-3EKF1503V_1: Dist: Digi-Key; Dist P/N: P150KHCT-ND; Mfg: Panasonic; Mfgr P/N: ERJ-3EKF1503V; Price: 0.05
R95 R96 = ERJ-3EKF4990V: Dist: Digi-Key; Dist P/N: P499HCT-ND; Mfg: Panasonic; Mfgr P/N: ERJ-3EKF4990V; Price: 0.05
R97 R102 = ERJ-3EKF6652V: Dist: Digi-Key; Dist P/N: P66.5KHCT-ND; Mfg: Panasonic; Mfgr P/N: ERJ-3EKF6652V; Price: 0.05
R98 R103 = ERJ-3EKF1000V: Dist: Digi-Key; Dist P/N: P100HCT-ND; Mfg: Panasonic; Mfgr P/N: ERJ-3EKF1000V; Price: 0.05
U1 = LP324DR: Dist: Digi-Key; Dist P/N: 296-17953-1-ND; Mfg: TI; HelpURL: http://www.ti.com/lit/ds/symlink/lp2902.pdf; Price: 0.62; Value: LP324DR; Mfgr P/N: LP324DR
U2 = TCMT1600: Dist P/N: 751-1374-1-ND; Dist: Digikey; Mfg: Vishay; HelpURL: http://www.vishay.com/doc?83512; Price: 0.73; Mfgr P/N: TCMT1600
U4 = MCP1804T-5002I/OT: Dist: Digi-Key; Dist P/N: MCP1804T-5002I/OTCT-ND; Mfg: Microchip; Price: 0.80; HelpURL: http://ww1.microchip.com/downloads/en/DeviceDoc/22200C.pdf; Mfgr P/N: MCP1804T-5002I/OT
U5 = ISO1050DUBR: Dist: Digi-Key; Dist P/N: 296-24818-1-ND; Mfg: TI; Mfgr P/N: ISO1050DUBR; Price: 4.02; HelpURL: http://www.ti.com/lit/ds/symlink/iso1050.pdf
U6 = PESD1CAN,215: Dist: Digi-Key; Dist P/N: 568-4032-1-ND; Mfg: NXP; Mfgr P/N: PESD1CAN,215; Price: 0.44; HelpURL: http://www.nxp.com/documents/data_sheet/PESD1CAN.pdf
U7 = MCP3425A0T-E/CH: IC ADC I2C 16-Bit 15SPS SOT23-6; Dist P/N: MCP3425A0T-E/CHCT-ND; Mfg: Microchip; Dist: Digikey; Mfgr P/N: MCP3425A0T-E/CH; HelpURL: http://ww1.microchip.com/downloads/en/DeviceDoc/22072B.pdf; Price: 2.60; Value: MCP3425A0T-E/CH
U8 = LP358DR: Dist: Mouser; Dist P/N: 595-LP358DR; Mfg: Texas Instruments; HelpURL: http://www.ti.com/litv/slos475; Price: 0.642; Mfgr P/N: LP358DR
U9 = DSPIC33EP32GP504-I/PT: Dist: Digi-Key; Dist P/N: DSPIC33EP128GP504-I/PT-ND; Mfg: Microchip; Mfgr P/N: DSPIC33EP128GP504-I/PT; Price: 3.70; HelpURL: http://ww1.microchip.com/downloads/en/DeviceDoc/70657g.pdf
U10 = ISL21080CIH320Z-TK: Dist: Digi-Key; Dist P/N: ISL21080CIH320Z-TKCT-ND; Mfg: Intersil; Price: 1.69; Mfgr P/N: ISL21080CIH320Z-TK
U11 = TPS54062DGKR: Dist: Digi-Key; Dist P/N: 296-28780-1-ND; Mfg: TI; Mfgr P/N: TPS54062DGKR; Price: 2.25; HelpURL: http://www.ti.com/general/docs/suppproductinfo.tsp?distId=10&gotoUrl=http%3A%2F%2Fwww.ti.com%2Flit%2Fgpn%2Ftps54062
U12 = 24LC16BT-I/OT: Dist: Digikey; Dist P/N: 24LC16BT-I/OTCT-ND; Mfg: Microchip; Mfgr P/N: 24LC16BT-I/OT; Price: 0.38; HelpURL: http://www.microchip.com/mymicrochip/filehandler.aspx?ddocname=en011855
X1 = ABM8G-20.000MHZ-4Y-T3: Dist: Digi-Key; Dist P/N: 535-10911-1-ND; Mfg: Abracon; Mfgr P/N: ABM8G-20.000MHZ-4Y-T3; Price: 1.01; HelpURL: http://www.abracon.com/Resonators/ABM8G.pdf

## Assembly variants
Three Resistor: not fitted J8 J9 X1